# Altium project USB_2.0_HUB.PrjPcb
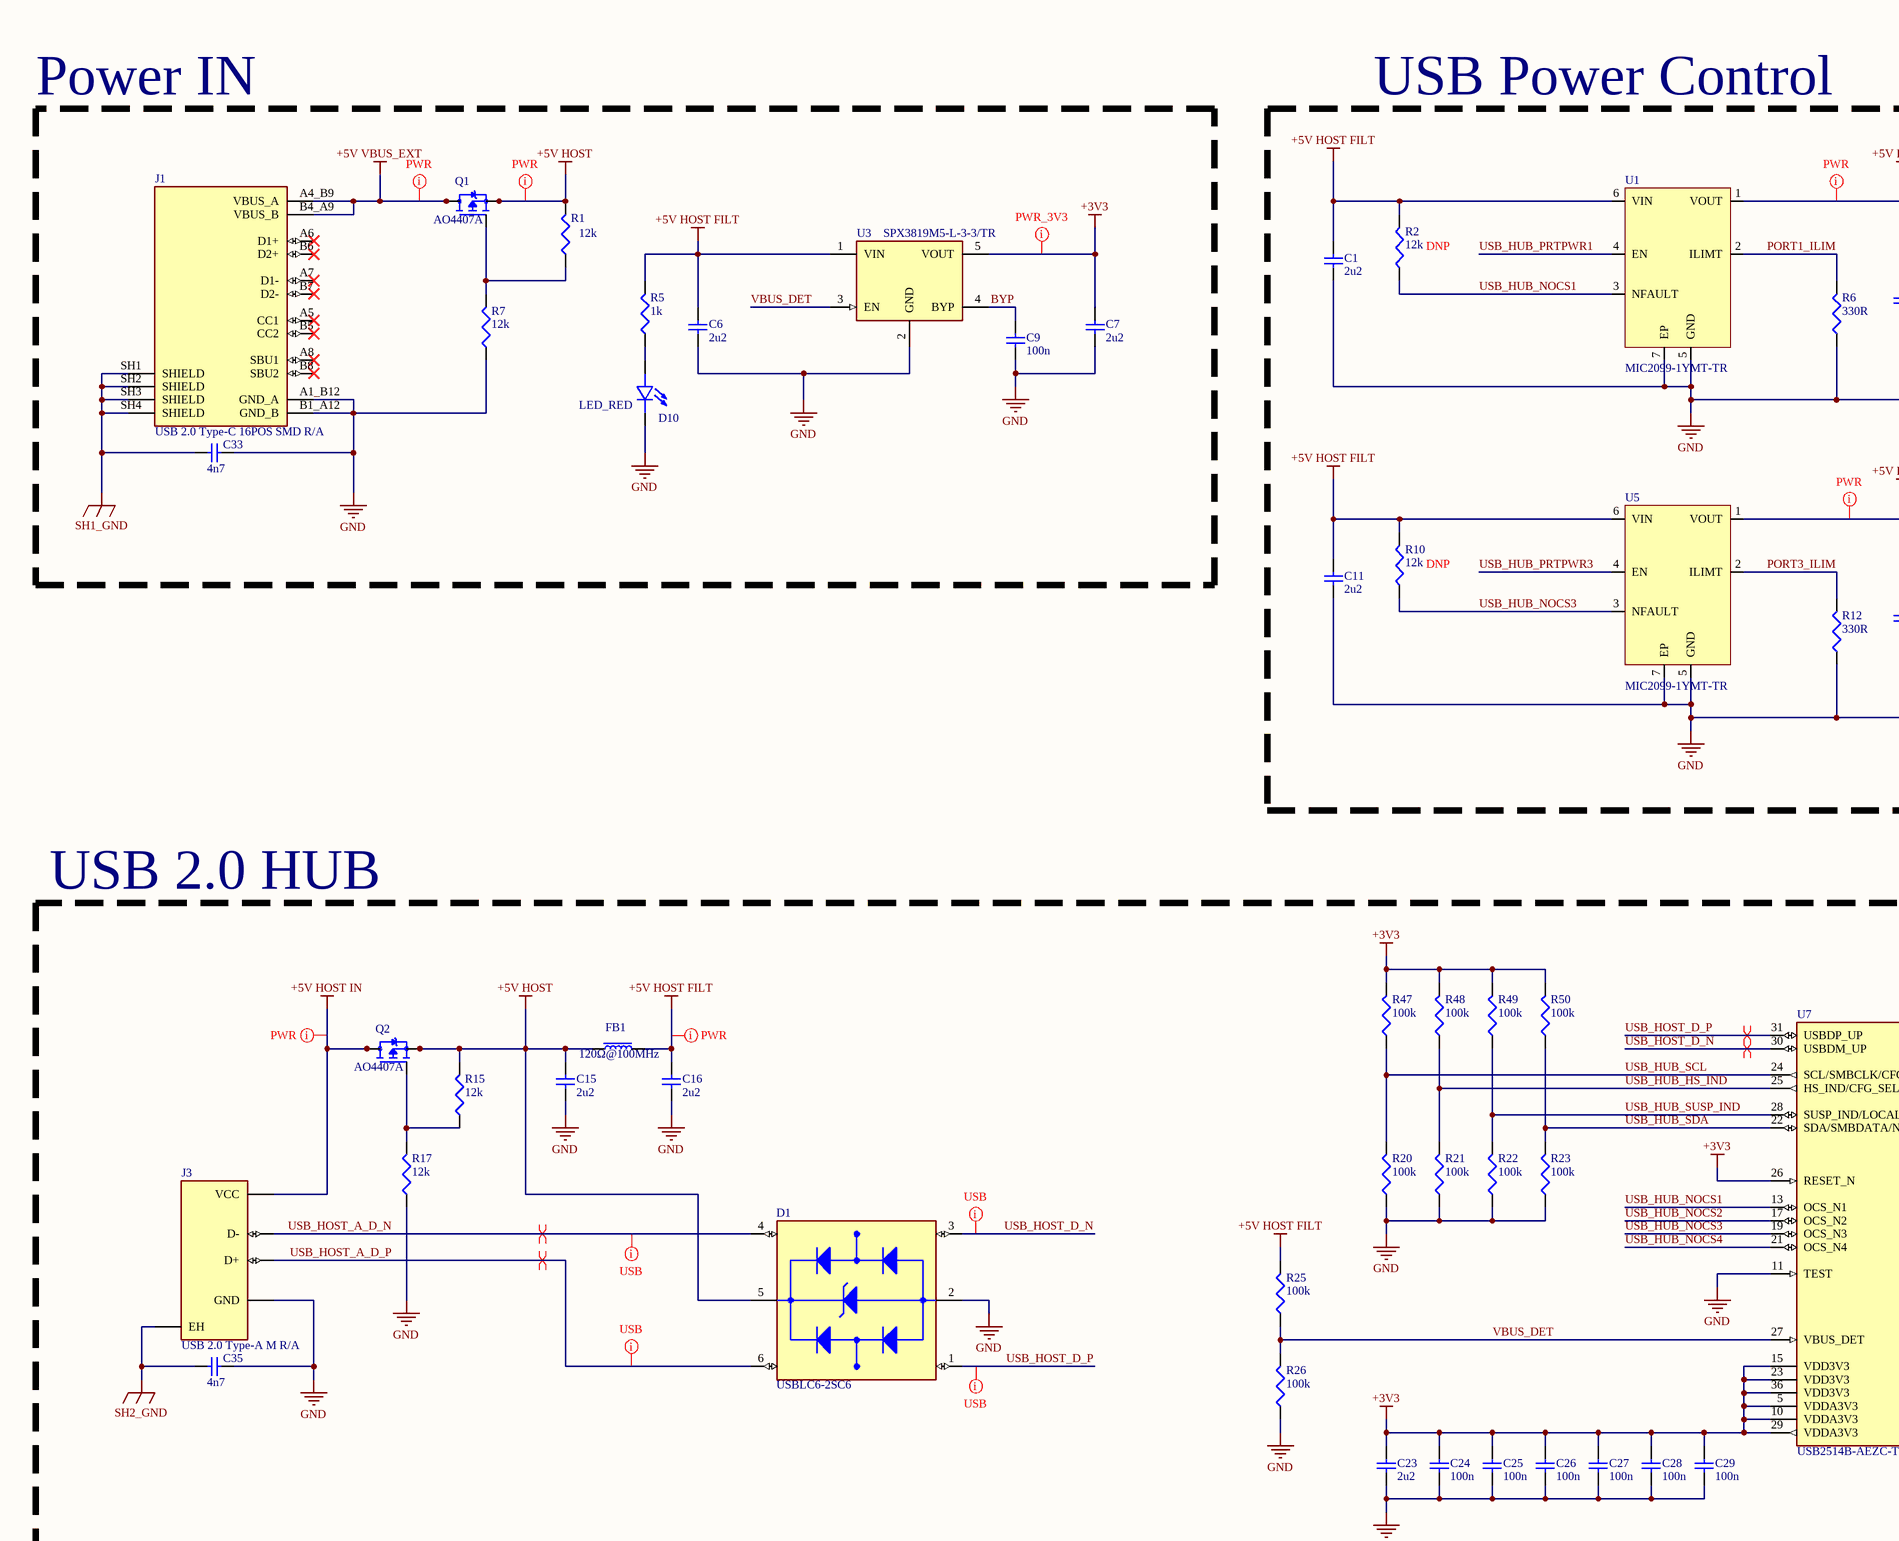
[diagram p0: USB_HUB_IC.SchDoc, top left]
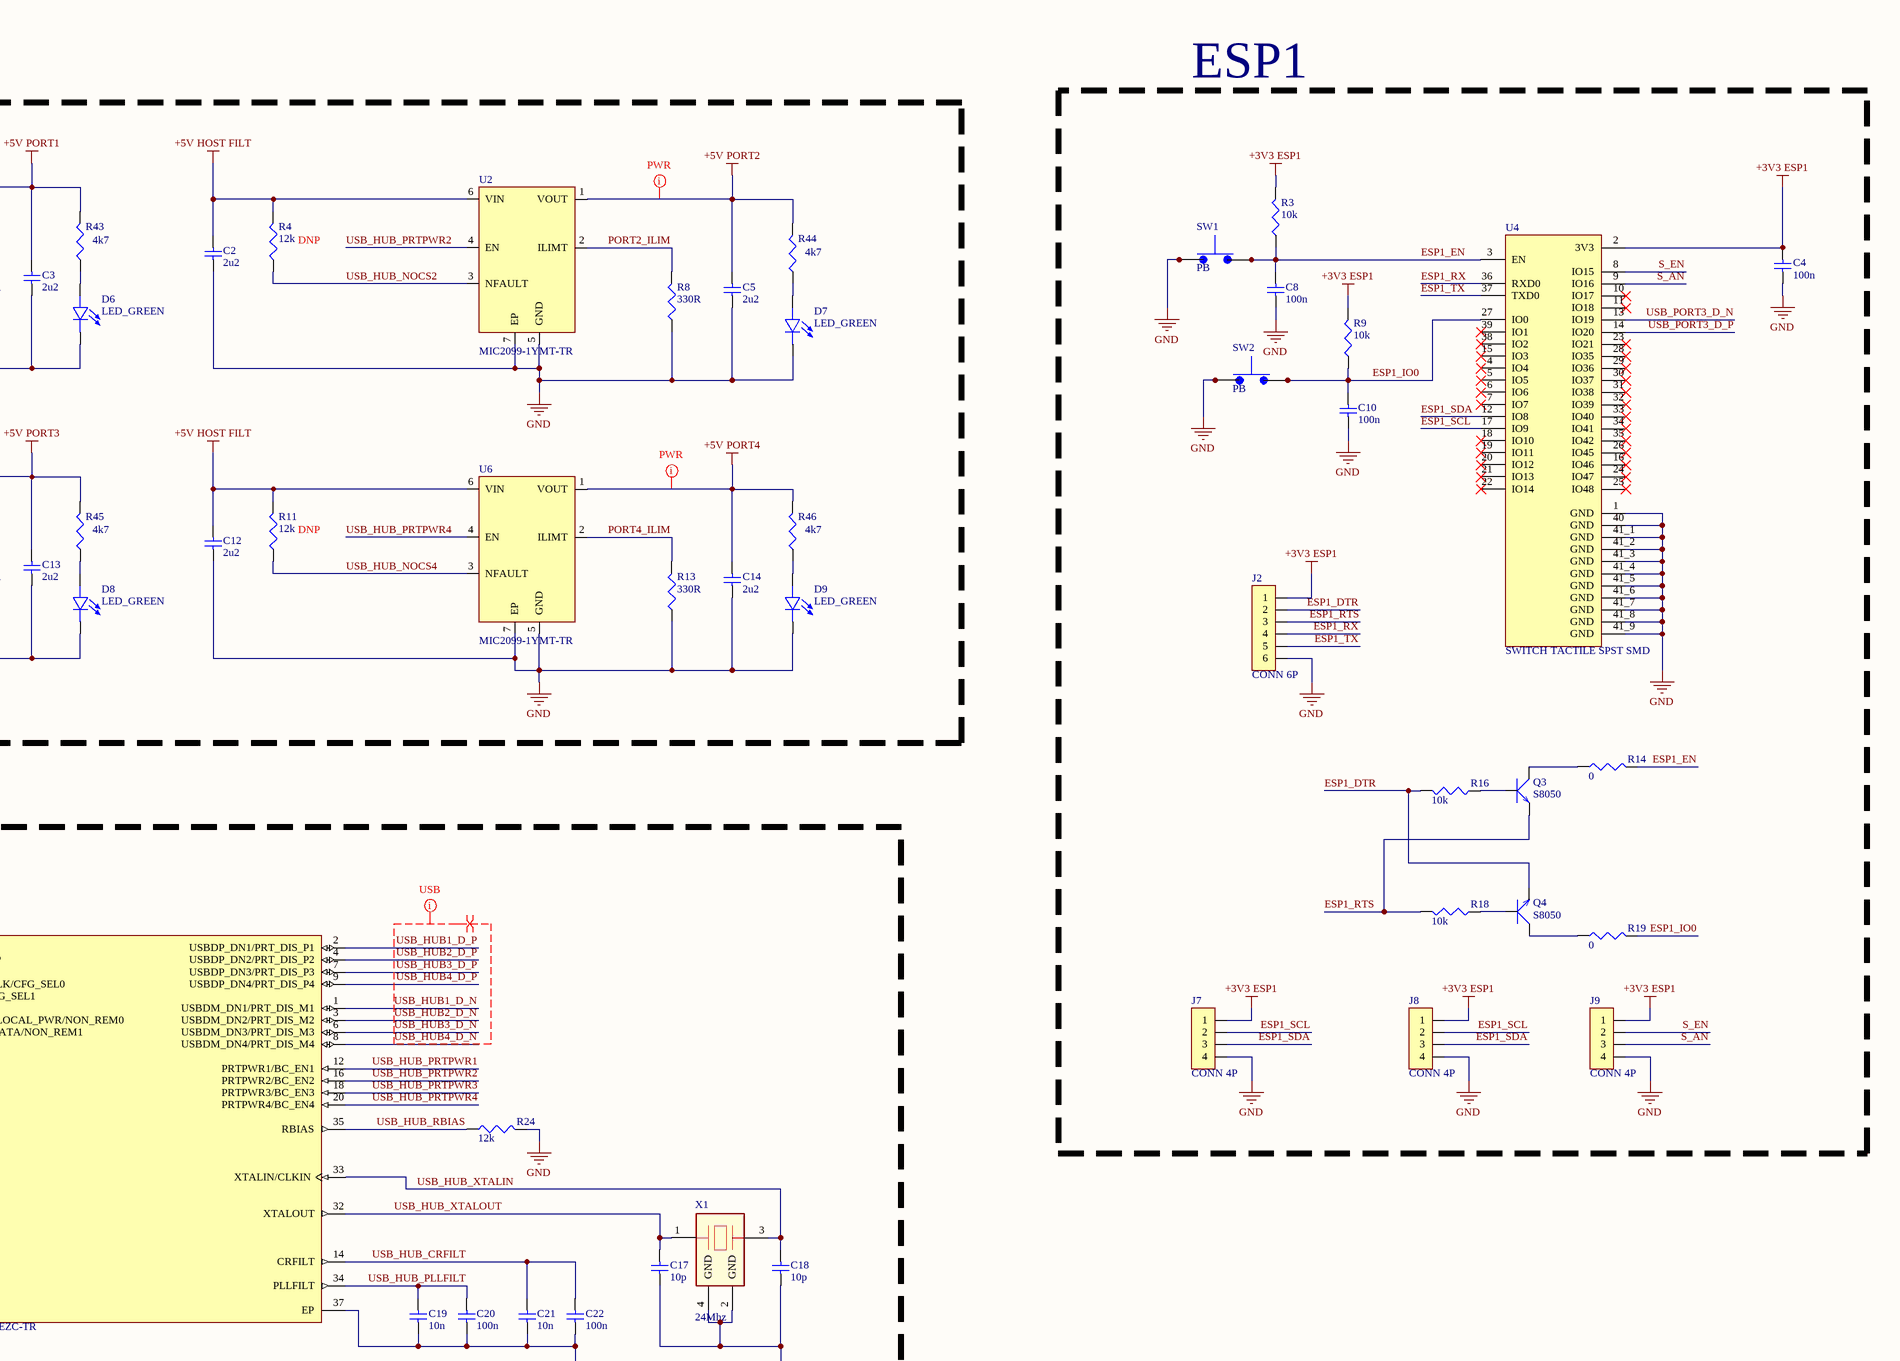
[diagram p1: USB_HUB_IC.SchDoc, top right]
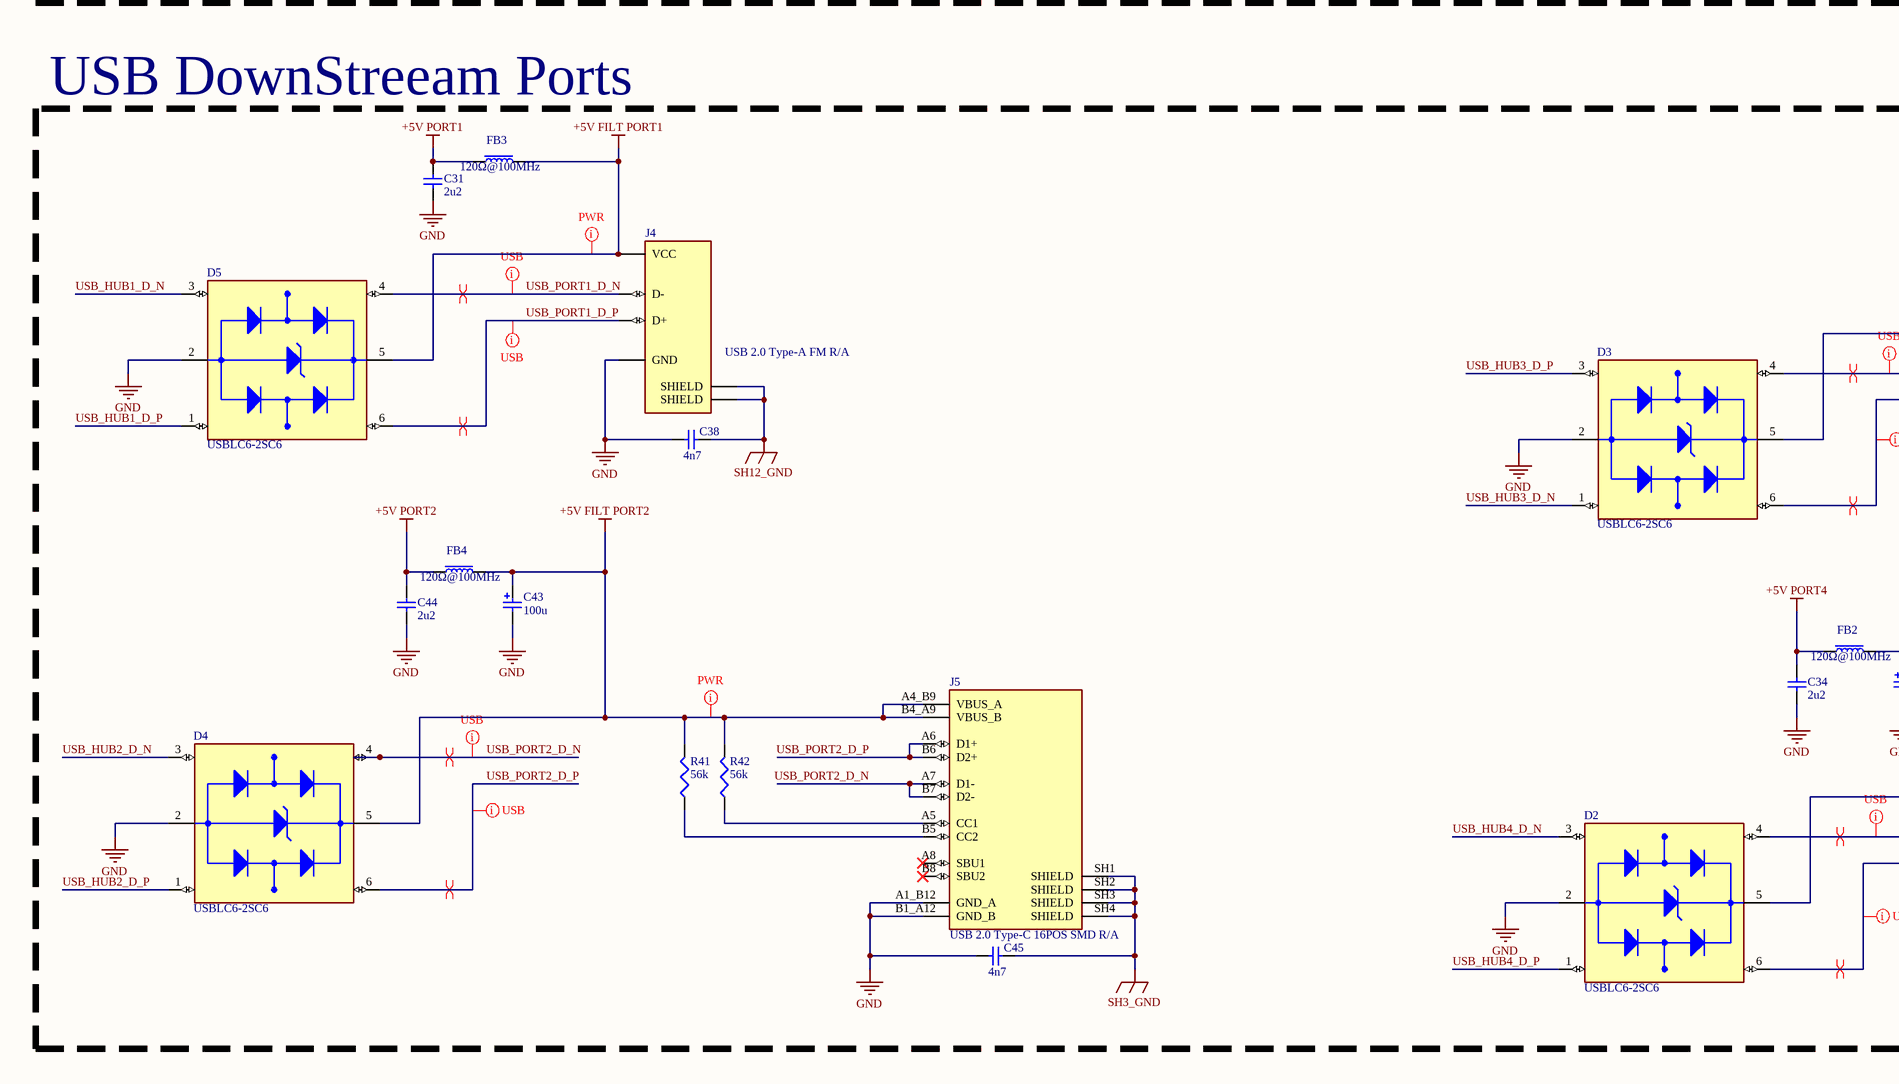
[diagram p2: USB_HUB_IC.SchDoc, bottom left]
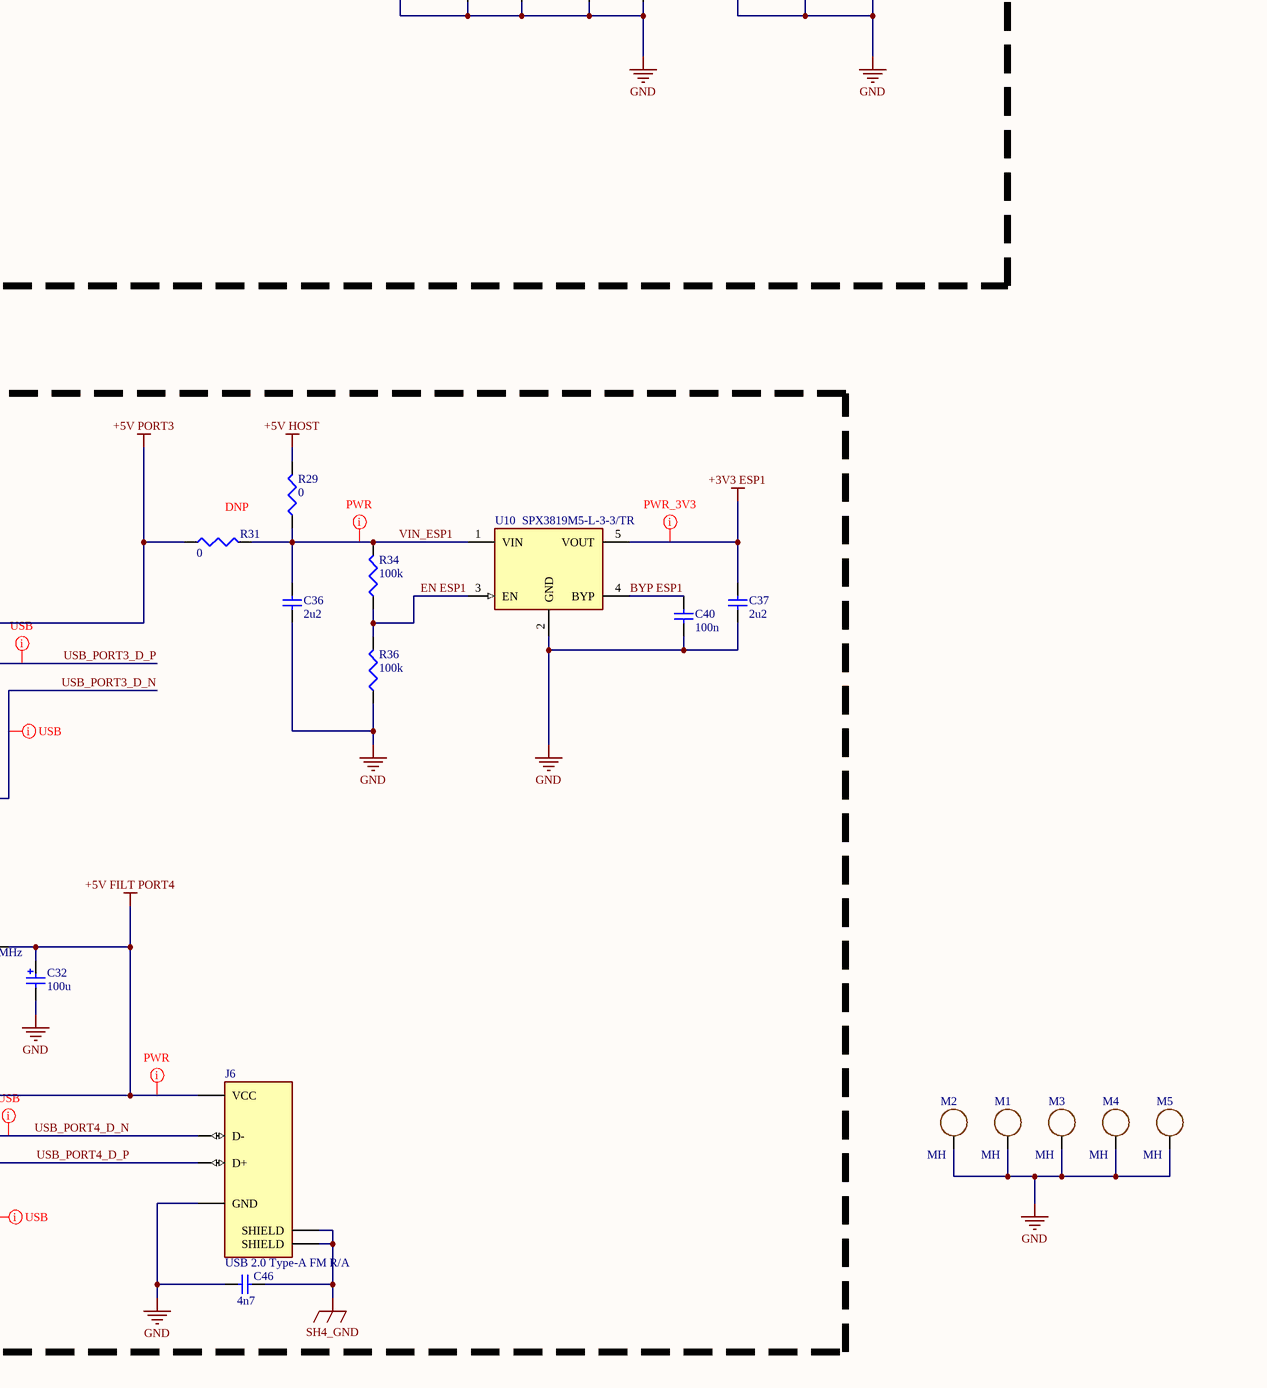
[diagram p3: USB_HUB_IC.SchDoc, bottom right]
1 sheet, 125 parts. Net scope: global (net labels, ports and power ports of the same name join across sheets).
Board file: USB2.0_HUB.PcbDoc

## Sheet USB_HUB_IC.SchDoc
size A1; SheetNumber: 1; SheetTotal: 1

### Parts
C1  2u2  [CAP_0603]
C2  2u2  [CAP_0603]
C3  2u2  [CAP_0603]
C4  100n  [CAP_0603]
C5  2u2  [CAP_0603]
C6  2u2  [CAP_0603]
C7  2u2  [CAP_0603]
C8  100n  [CAP_0603]
C9  100n  [CAP_0603]
C10  100n  [CAP_0603]
C11  2u2  [CAP_0603]
C12  2u2  [CAP_0603]
C13  2u2  [CAP_0603]
C14  2u2  [CAP_0603]
C15  2u2  [CAP_0603]
C16  2u2  [CAP_0603]
C17  10p  [CAP_0603]
C18  10p  [CAP_0603]
C19  10n  [CAP_0603]
C20  100n  [CAP_0603]
C21  10n  [CAP_0603]
C22  100n  [CAP_0603]
C23  2u2  [CAP_0603]
C24  100n  [CAP_0603]
C25  100n  [CAP_0603]
C26  100n  [CAP_0603]
C27  100n  [CAP_0603]
C28  100n  [CAP_0603]
C29  100n  [CAP_0603]
C31  2u2  [CAP_0603]
C32  100u  [CAP_SMD]
C33  4n7  [CAP_0603]
C34  2u2  [CAP_0603]
C35  4n7  [CAP_0603]
C36  2u2  [CAP_0603]
C37  2u2  [CAP_0603]
C38  4n7  [CAP_0603]
C40  100n  [CAP_0603]
C43  100u  [CAP_SMD]
C44  2u2  [CAP_0603]
C45  4n7  [CAP_0603]
C46  4n7  [CAP_0603]
D1  USBLC6-2SC6  [USBLC6-2SC6_SOT-23-6L]
D2  USBLC6-2SC6  [USBLC6-2SC6_SOT-23-6L]
D3  USBLC6-2SC6  [USBLC6-2SC6_SOT-23-6L]
D4  USBLC6-2SC6  [USBLC6-2SC6_SOT-23-6L]
D5  USBLC6-2SC6  [USBLC6-2SC6_SOT-23-6L]
D6  LED_GREEN  [LED_0805]
D7  LED_GREEN  [LED_0805]
D8  LED_GREEN  [LED_0805]
D9  LED_GREEN  [LED_0805]
D10  LED_RED  [LED_0805]
FB1  120Ω@100MHz  [FB_0805]
FB2  120Ω@100MHz  [FB_0805]
FB3  120Ω@100MHz  [FB_0805]
FB4  120Ω@100MHz  [FB_0805]
J1  USB 2.0 Type-C 16POS SMD R/A  [GT-USB-7010B]
J2  CONN 6P  [JST_6P_GH_W/A]
J3  USB 2.0 Type-A M R/A  [Male USB 2.0 Type-A 4POS SMD R/A]
J4  USB 2.0 Type-A FM R/A  [Femalem USB 2.0 Type-A 4POS SMD R/A]
J5  USB 2.0 Type-C 16POS SMD R/A  [GT-USB-7010B]
J6  USB 2.0 Type-A FM R/A  [Femalem USB 2.0 Type-A 4POS SMD R/A]
J7  CONN 4P  [JST_4P_GH_R/A]
J8  CONN 4P  [JST_4P_GH_R/A]
J9  CONN 4P  [JST_4P_GH_R/A]
M1  MH  [M2_Mounting_Hole]
M2  MH  [M2_Mounting_Hole]
M3  MH  [M2_Mounting_Hole]
M4  MH  [M2_Mounting_Hole]
M5  MH  [M2_Mounting_Hole]
Q1  AO4407A  [AO4407A_SOIC-8]
Q2  AO4407A  [AO4407A_SOIC-8]
Q3  S8050  [S8050_SOT-23]
Q4  S8050  [S8050_SOT-23]
R1  12k  [RES_0603]
R2  12k  [RES_0603]
R3  10k  [RES_0603]
R4  12k  [RES_0603]
R5  1k  [RES_0603]
R6  330R  [RES_0603]
R7  12k  [RES_0603]
R8  330R  [RES_0603]
R9  10k  [RES_0603]
R10  12k  [RES_0603]
R11  12k  [RES_0603]
R12  330R  [RES_0603]
R13  330R  [RES_0603]
R14  0  [RES_0603]
R15  12k  [RES_0603]
R16  10k  [RES_0603]
R17  12k  [RES_0603]
R18  10k  [RES_0603]
R19  0  [RES_0603]
R20  100k  [RES_0603]
R21  100k  [RES_0603]
R22  100k  [RES_0603]
R23  100k  [RES_0603]
R24  12k  [RES_0603]
R25  100k  [RES_0603]
R26  100k  [RES_0603]
R29  0  [RES_0603]
R31  0  [RES_0603]
R34  100k  [RES_0603]
R36  100k  [RES_0603]
R41  56k  [RES_0603]
R42  56k  [RES_0603]
R43  4k7  [RES_0603]
R44  4k7  [RES_0603]
R45  4k7  [RES_0603]
R46  4k7  [RES_0603]
R47  100k  [RES_0603]
R48  100k  [RES_0603]
R49  100k  [RES_0603]
R50  100k  [RES_0603]
SW1  PB  [ALPSALPINE SKRPABE010]
SW2  PB  [ALPSALPINE SKRPABE010]
U1  MIC2099-1YMT-TR  [MIC2099_UDFN-6]
U2  MIC2099-1YMT-TR  [MIC2099_UDFN-6]
U3  SPX3819M5-L-3-3/TR  [SPX3819M5-L-3-3/TR_SOT-23-5]
U4  SWITCH TACTILE SPST SMD  [XCVR_ESP32-S3-WROOM-1U]
U5  MIC2099-1YMT-TR  [MIC2099_UDFN-6]
U6  MIC2099-1YMT-TR  [MIC2099_UDFN-6]
U7  USB2514B-AEZC-TR  [USB2514B_VQFN-36-EP(6x6)]
U10  SPX3819M5-L-3-3/TR  [SPX3819M5-L-3-3/TR_SOT-23-5]
X1  24Mhz  [SMD3225-4P]

### Blocks framed on the sheet
Power IN: C6 C7 C9 C33 D10 J1 Q1 R1 R5 R7 U3
USB Power Control: C1-C3 C5 C11-C14 D6-D9 R2 R4 R6 R8 R10-R13 R43-R46 U1 U2 U5 U6
ESP1: C4 C8 C10 J2 J7-J9 Q3 Q4 R3 R9 R14 R16 R18 R19 SW1 SW2 U4
USB 2.0 HUB: C15-C29 C35 D1 FB1 J3 Q2 R15 R17 R20-R26 R47-R50 U7 X1
USB DownStreeam Ports: C31 C32 C34 C36-C38 C40 C43-C46 D2-D5 FB2-FB4 J4-J6 R29 R31 R34 R36 R41 R42 U10

### Nets
+3V3: C7.2 C23.2 C24.2 C25.2 C26.2 C27.2 C28.2 C29.2 R47.2 R48.2 R49.2 R50.2 U3.5(VOUT) U7.5(VDDA3V3) U7.10(VDDA3V3) U7.15(VDD3V3) U7.23(VDD3V3) U7.26(RESET_N) U7.29(VDDA3V3) U7.36(VDD3V3)
+3V3 ESP1: C4.2 C37.2 J2.1 J7.1 J8.1 J9.1 R3.2 R9.2 U4.2(3V3) U10.5(VOUT)
+5V FILT PORT1: D5.5(VBUS) FB3.2 J4.1(VCC)
+5V FILT PORT2: C43.1 D4.5(VBUS) FB4.2 J5.A4_B9(VBUS_A) J5.B4_A9(VBUS_B) R41.2 R42.2
+5V FILT PORT4: C32.1 D2.5(VBUS) FB2.2 J6.1(VCC)
+5V HOST: C15.2 D1.5(VBUS) FB1.1 Q1.1(S) Q1.2(S) Q1.3(S) Q2.1(S) Q2.2(S) Q2.3(S) R1.2 R15.2 R29.2
+5V HOST FILT: C1.2 C2.2 C6.2 C11.2 C12.2 C16.2 FB1.2 R2.2 R4.2 R5.2 R10.2 R11.2 R25.2 U1.6(VIN) U2.6(VIN) U3.1(VIN) U5.6(VIN) U6.6(VIN)
+5V HOST IN: J3.1(VCC) Q2.5(D) Q2.6(D) Q2.7(D) Q2.8(D)
+5V PORT1: C3.2 C31.2 FB3.1 R43.2 U1.1(VOUT)
+5V PORT2: C5.2 C44.2 FB4.1 R44.2 U2.1(VOUT)
+5V PORT3: C13.2 D3.5(VBUS) R31.1 R45.2 U5.1(VOUT)
+5V PORT4: C14.2 C34.2 FB2.1 R46.2 U6.1(VOUT)
+5V VBUS_EXT: J1.A4_B9(VBUS_A) J1.B4_A9(VBUS_B) Q1.5(D) Q1.6(D) Q1.7(D) Q1.8(D)
GND: C1.1 C2.1 C3.1 C4.1 C5.1 C6.1 C7.1 C8.1 C9.1 C10.1 C11.1 C12.1 C13.1 C14.1 C15.1 C16.1 C17.1 C18.1 C19.1 C20.1 C21.1 C22.1 C23.1 C24.1 C25.1 C26.1 C27.1 C28.1 C29.1 C31.1 C32.2 C33.2 C34.1 C35.2 C36.1 C37.1 C38.1 C40.1 C43.2 C44.1 C45.1 C46.1 D1.2(GND) D2.2(GND) D3.2(GND) D4.2(GND) D5.2(GND) D6.C D7.C D8.C D9.C D10.C J1.A1_B12(GND_A) J1.B1_A12(GND_B) J2.6 J3.4(GND) J4.4(GND) J5.A1_B12(GND_A) J5.B1_A12(GND_B) J6.4(GND) J7.4 J8.4 J9.4 M1.1(H) M2.1(H) M3.1(H) M4.1(H) M5.1(H) R6.1 R7.1 R8.1 R12.1 R13.1 R17.1 R20.1 R21.1 R22.1 R23.1 R24.2 R26.1 R36.1 SW1.1 SW1.2 SW2.1 SW2.2 U1.5(GND) U1.7(EP) U2.5(GND) U2.7(EP) U3.2(GND) U4.1(GND) U4.40(GND) U4.41_1(GND) U4.41_2(GND) U4.41_3(GND) U4.41_4(GND) U4.41_5(GND) U4.41_6(GND) U4.41_7(GND) U4.41_8(GND) U4.41_9(GND) U5.5(GND) U5.7(EP) U6.5(GND) U6.7(EP) U7.11(TEST) U7.37(EP) U10.2(GND) X1.2(GND) X1.4(GND)
SH1_GND: C33.1 J1.SH1(SHIELD) J1.SH2(SHIELD) J1.SH3(SHIELD) J1.SH4(SHIELD)
SH2_GND: C35.1 J3.5(EH)
SH3_GND: C45.2 J5.SH1(SHIELD) J5.SH2(SHIELD) J5.SH3(SHIELD) J5.SH4(SHIELD)
SH4_GND: C46.2 J6.5(SHIELD) J6.6(SHIELD)
SH12_GND: C38.2 J4.5(SHIELD) J4.6(SHIELD)
BYP: C9.2 U3.4(BYP)
BYP ESP1: C40.2 U10.4(BYP)
EN ESP1: R34.1 R36.2 U10.3(EN)
ESP1_DTR: J2.2 Q4.2(E) R16.2
ESP1_EN: C8.2 R3.1 R14.2 SW1.3 SW1.4 U4.3(EN)
ESP1_IO0: C10.2 R9.1 R19.2 SW2.3 SW2.4 U4.27(IO0)
ESP1_RTS: J2.3 Q3.2(E) R18.2
ESP1_RX: J2.4 U4.36(RXD0)
ESP1_SCL: J7.2 J8.2 U4.17(IO9)
ESP1_SDA: J7.3 J8.3 U4.12(IO8)
ESP1_TX: J2.5 U4.37(TXD0)
PORT1_ILIM: R6.2 U1.2(ILIMT)
PORT2_ILIM: R8.2 U2.2(ILIMT)
PORT3_ILIM: R12.2 U5.2(ILIMT)
PORT4_ILIM: R13.2 U6.2(ILIMT)
S_AN: J9.3 U4.9(IO16)
S_EN: J9.2 U4.8(IO15)
USB_HOST_A_D_N: D1.4(I/O2_OUT) J3.2(D-)
USB_HOST_A_D_P: D1.6(I/O1_OUT) J3.3(D+)
USB_HOST_D_N: D1.3(I/O2_IN) U7.30(USBDM_UP)
USB_HOST_D_P: D1.1(I/O1_IN) U7.31(USBDP_UP)
USB_HUB1_D_N: D5.3(I/O2_IN) U7.1(USBDM_DN1/PRT_DIS_M1)
USB_HUB1_D_P: D5.1(I/O1_IN) U7.2(USBDP_DN1/PRT_DIS_P1)
USB_HUB2_D_N: D4.3(I/O2_IN) U7.3(USBDM_DN2/PRT_DIS_M2)
USB_HUB2_D_P: D4.1(I/O1_IN) U7.4(USBDP_DN2/PRT_DIS_P2)
USB_HUB3_D_N: D3.1(I/O1_IN) U7.6(USBDM_DN3/PRT_DIS_M3)
USB_HUB3_D_P: D3.3(I/O2_IN) U7.7(USBDP_DN3/PRT_DIS_P3)
USB_HUB4_D_N: D2.3(I/O2_IN) U7.8(USBDM_DN4/PRT_DIS_M4)
USB_HUB4_D_P: D2.1(I/O1_IN) U7.9(USBDP_DN4/PRT_DIS_P4)
USB_HUB_CRFILT: C21.2 C22.2 U7.14(CRFILT)
USB_HUB_HS_IND: R21.2 R48.1 U7.25(HS_IND/CFG_SEL1)
USB_HUB_NOCS1: R2.1 U1.3(NFAULT) U7.13(OCS_N1)
USB_HUB_NOCS2: R4.1 U2.3(NFAULT) U7.17(OCS_N2)
USB_HUB_NOCS3: R10.1 U5.3(NFAULT) U7.19(OCS_N3)
USB_HUB_NOCS4: R11.1 U6.3(NFAULT) U7.21(OCS_N4)
USB_HUB_PLLFILT: C19.2 C20.2 U7.34(PLLFILT)
USB_HUB_PRTPWR1: U1.4(EN) U7.12(PRTPWR1/BC_EN1)
USB_HUB_PRTPWR2: U2.4(EN) U7.16(PRTPWR2/BC_EN2)
USB_HUB_PRTPWR3: U5.4(EN) U7.18(PRTPWR3/BC_EN3)
USB_HUB_PRTPWR4: U6.4(EN) U7.20(PRTPWR4/BC_EN4)
USB_HUB_RBIAS: R24.1 U7.35(RBIAS)
USB_HUB_SCL: R20.2 R47.1 U7.24(SCL/SMBCLK/CFG_SEL0)
USB_HUB_SDA: R23.2 R50.1 U7.22(SDA/SMBDATA/NON_REM1)
USB_HUB_SUSP_IND: R22.2 R49.1 U7.28(SUSP_IND/LOCAL_PWR/NON_REM0)
USB_HUB_XTALIN: C18.2 U7.33(XTALIN/CLKIN) X1.3
USB_HUB_XTALOUT: C17.2 U7.32(XTALOUT) X1.1
USB_PORT1_D_N: D5.4(I/O2_OUT) J4.2(D-)
USB_PORT1_D_P: D5.6(I/O1_OUT) J4.3(D+)
USB_PORT2_D_N: D4.4(I/O2_OUT) J5.A7(D1-) J5.B7(D2-)
USB_PORT2_D_P: D4.6(I/O1_OUT) J5.A6(D1+) J5.B6(D2+)
USB_PORT3_D_N: D3.6(I/O1_OUT) U4.13(IO19)
USB_PORT3_D_P: D3.4(I/O2_OUT) U4.14(IO20)
USB_PORT4_D_N: D2.4(I/O2_OUT) J6.2(D-)
USB_PORT4_D_P: D2.6(I/O1_OUT) J6.3(D+)
VBUS_DET: R25.1 R26.2 U3.3(EN) U7.27(VBUS_DET)
VIN_ESP1: C36.2 R29.1 R31.2 R34.2 U10.1(VIN)
NetD6_A: D6.A R43.1
NetD7_A: D7.A R44.1
NetD8_A: D8.A R45.1
NetD9_A: D9.A R46.1
NetD10_A: D10.A R5.1
NetJ5_A5: J5.A5(CC1) R42.1
NetJ5_B5: J5.B5(CC2) R41.1
NetQ1_4: Q1.4(G) R1.1 R7.2
NetQ2_4: Q2.4(G) R15.1 R17.2
NetQ3_1: Q3.1(B) R16.1
NetQ3_3: Q3.3(C) R14.1
NetQ4_1: Q4.1(B) R18.1
NetQ4_3: Q4.3(C) R19.1

Not connected (* = marked no-connect by the designer): J1 A5(CC1)* A6(D1+)* A7(D1-)* A8(SBU1)* B5(CC2)* B6(D2+)* B7(D2-)* B8(SBU2)*; J5 A8(SBU1)* B8(SBU2)*; U4 4(IO4)* 5(IO5)* 6(IO6)* 7(IO7)* 10(IO17)* 11(IO18)* 15(IO3)* 16(IO46)* 18(IO10)* 19(IO11)* 20(IO12)* 21(IO13)* 22(IO14)* 23(IO21)* 24(IO47)* 25(IO48)* 26(IO45)* 28(IO35)* 29(IO36)* 30(IO37)* 31(IO38)* 32(IO39)* 33(IO40)* 34(IO41)* 35(IO42)* 38(IO2)* 39(IO1)*

### Layout directives
differential pair: USB_HOST_A_D_N, USB_HOST_A_D_P, USB_HOST_D_N, USB_HOST_D_P, USB_HUB1_D_N, USB_HUB1_D_P, USB_HUB2_D_N, USB_HUB2_D_P, USB_HUB3_D_N, USB_HUB3_D_P, USB_HUB4_D_N, USB_HUB4_D_P, USB_PORT1_D_N, USB_PORT1_D_P, USB_PORT2_D_N, USB_PORT2_D_P, USB_PORT3_D_N, USB_PORT3_D_P, USB_PORT4_D_N, USB_PORT4_D_P
net class USB: USB_HOST_A_D_N, USB_HOST_A_D_P, USB_HOST_D_N, USB_HOST_D_P, USB_HUB1_D_N, USB_HUB1_D_P, USB_HUB2_D_N, USB_HUB2_D_P, USB_HUB3_D_N, USB_HUB3_D_P, USB_HUB4_D_N, USB_HUB4_D_P, USB_PORT1_D_N, USB_PORT1_D_P, USB_PORT2_D_N, USB_PORT2_D_P, USB_PORT3_D_N, USB_PORT3_D_P, USB_PORT4_D_N, USB_PORT4_D_P
net class PWR: +5V FILT PORT1, +5V FILT PORT2, +5V FILT PORT4, +5V HOST, +5V HOST FILT, +5V HOST IN, +5V PORT1, +5V PORT2, +5V PORT3, +5V PORT4, +5V VBUS_EXT, VIN_ESP1
net class PWR_3V3: +3V3, +3V3 ESP1

### Notes on the sheet
- (near R2) DNP
- (near R4) DNP
- (near R10) DNP
- (near R11) DNP
- (near R31) DNP

### Library data of the parts
C1-C3 C5 C11-C16 C23 C31 C34 C44 = YAGEO CC0603KRX7R9BB104_1: CAP CER 2.2uF 16V X7R 0603; Manufacturer: YAGEO; Manufacturer Part Number: CC0603KRX7R7BB225; LCSC Part Number: C914769; Package: 0603; Mounting Type: SMD; ComponentLink2Description: Digikey Link; ComponentLink3Description: LCSC Link; ComponentLink3URL: https://www.lcsc.com/product-detail/C914769.html?spm=wm.fly.bg.0.xh___wm.sxq.dhl.mly.12-0-4&lcsc_vid=QlAIX1RQQQJfX1VRTwcNAQJXTlRaUQBVEQBYAwJfFFcxVlNRQ1VcX1FSRFRbUDsOAxUeFF5JWBYZEEoKFBINSQcJGk4dAgUUFAk%3D
C4 C8-C10 C20 C22 C24-C29 C40 = YAGEO CC0603KRX7R9BB104: 100nF ±10% 50V Ceramic Capacitor X7R 0603; Manufacturer: YAGEO; Manufacturer Part Number: CC0603KRX7R9BB104; LCSC Part Number: C14663; Package: 0603; Mounting Type: SMD; ComponentLink2Description: Digikey Link; ComponentLink3Description: LCSC Link; ComponentLink3URL: https://www.lcsc.com/product-detail/C14663.html?spm=wm.fly.bg.0.xh___wm.sxq.dhl.mly.12-0-4&lcsc_vid=QlAIX1RQQQJfX1VRTwcNAQJXTlRaUQBVEQBYAwJfFFcxVlNRQ1VcX1FSRFRbUDsOAxUeFF5JWBYZEEoKFBINSQcJGk4dAgUUFAk%3D
C6 C7 C36 C37 = YAGEO CC0603KRX7R7BB225: 2.2uF ±10% 16V Ceramic Capacitor X7R 0603; Manufacturer: YAGEO; Manufacturer Part Number: CC0603KRX7R7BB225; LCSC Part Number: C914769; Package: 0603; Mounting Type: SMD; ComponentLink2Description: Digikey Link; ComponentLink3Description: LCSC Link; ComponentLink3URL: https://www.lcsc.com/product-detail/C914769.html?spm=wm.fly.bg.0.xh___wm.sxq.dhl.mly.12-0-4&lcsc_vid=QlAIX1RQQQJfX1VRTwcNAQJXTlRaUQBVEQBYAwJfFFcxVlNRQ1VcX1FSRFRbUDsOAxUeFF5JWBYZEEoKFBINSQcJGk4dAgUUFAk%3D
C17 C18 = YAGEO CC0603FRNPO9BN100: 10pF ±1% 50V Ceramic Capacitor NP0 0603; Manufacturer: YAGEO; Manufacturer Part Number: CC0603FRNPO9BN100; LCSC Part Number: C309467; Package: 0603; Mounting Type: SMD; ComponentLink2Description: Digikey Link; ComponentLink3Description: LCSC Link; ComponentLink3URL: https://www.lcsc.com/product-detail/C309467.html?spm=wm.fly.bg.0.xh___wm.fly.dhl.mly.12-0-4&lcsc_vid=QlAIX1RQQQJfX1VRTwcNAQJXTlRaUQBVEQBYAwJfFFcxVlNRQ1ReUVNTQlhZUDtW
C19 C21 = YAGEO CC0603KRX7R9BB103: 10nF ±10% 50V Ceramic Capacitor X7R 0603; Manufacturer: YAGEO; Manufacturer Part Number: CC0603KRX7R9BB103; LCSC Part Number: C100042; Package: 0603; Mounting Type: SMD; ComponentLink2Description: Digikey Link; ComponentLink3Description: LCSC Link; ComponentLink3URL: https://www.lcsc.com/product-detail/C100042.html?spm=wm.fly.bg.0.xh___wm.sxq.dhl.mly.12-0-4&lcsc_vid=QlAIX1RQQQJfX1VRTwcNAQJXTlRaUQBVEQBYAwJfFFcxVlNRQ1ReUVNTQlhZUDtW
C32 C43 = CAP ALUM 100uF: 100uF ±20% 16V Aluminum Electrolytic Capacitors 2000hrs@105℃; Manufacturer: PANASONIC; Manufacturer Part Number: EEEFT1C101AR; LCSC Part Number: C336792; Package: SMD; Mounting Type: SMD; ComponentLink2Description: Digikey Link; ComponentLink3Description: LCSC Link; ComponentLink3URL: https://www.lcsc.com/product-detail/C336792.html
C33 C35 C38 C45 C46 = YAGEO CC0603JRX7R9BB472: 4.7nF ±5% 50V Ceramic Capacitor X7R 0603; Manufacturer: YAGEO; Manufacturer Part Number: CC0603JRX7R9BB472; LCSC Part Number: C115060; Package: 0603; Mounting Type: SMD; ComponentLink2Description: Digikey Link; ComponentLink3Description: LCSC Link
D1-D5 = ST USBLC6-2SC6: 17VC Clamp 5A Ipp ESD DIODE SOT-23-6L; Manufacturer: ST; Manufacturer Part Number: USBLC6-2SC6; LCSC Part Number: C7519; Package: SOT-23-6L; ComponentLink1Description: Digikey Link; ComponentLink2Description: LCSC Link; ComponentLink2URL: https://www.lcsc.com/product-detail/C7519.html?s_z=n_usblc6-2sc6&spm=wm.ssy.bg.0.xh&lcsc_vid=QlAIX1RQQQJfX1VRTwcNAQJXTlRaUQBVEQBYAwJfFFcxVlNRQ1VbUVRUTldbUTsOAxUeFF5JWBYZEEoKFBINSQcJGk4%3D; Mounting Type: SMD
D6-D9 = LED_GREEN: Green 535nm LED Indication - Discrete 2.6V~3.2V 0805; Manufacturer: TONYU; Manufacturer Part Number: DY-S2012508UGC-T5-3T-03; LCSC Part Number: C7280944; Package: 0805; ComponentLink1Description: Digikey Link; ComponentLink2Description: LCSC Link; ComponentLink2URL: https://www.lcsc.com/product-detail/C7280944.html?spm=wm.fly.bg.2.xh&lcsc_vid=ElNWVwADR1BcUgADEwJfBlBQQ1hZBQcDEVVXV1VQE1kxVlNRQlFYU1JXRlJZVTsOAxUeFF5JWBYZEEoKFBINSQcJGk4%3D; Mounting Type: SMD
D10 = LED_RED: LED RED WATER CLEAR 0805 SMD; Manufacturer: Guiguang light; Manufacturer Part Number: GL0805UR01; LCSC Part Number: C51933307; Package: 0805; ComponentLink1Description: Digikey Link; ComponentLink2Description: LCSC Link; ComponentLink2URL: https://www.lcsc.com/product-detail/C51933307.html; Mounting Type: SMD
FB1-FB4 = muRata BLM21PG121SN1D: FERRITE BEAD 120Ω 0805 1LN; Manufacturer: muRata; Manufacturer Part Number: BLM21PG121SN1D; LCSC Part Number: C79382; Package: 0805; Mounting Type: SMD; ComponentLink2Description: Digikey Link; ComponentLink3Description: LCSC Link; ComponentLink3URL: https://www.lcsc.com/product-detail/C79382.html
J1 J5 = GT-USB-7010B: USB-C (USB TYPE-C) Receptacle Connector 16 Position Surface Mount, Right Angle; Manufacturer: G-Switch; Manufacturer Part Number: GT-USB-7010ASV; DigiKey Part Number: *; LCSC Part Number: C2988369; Package: SMD; Mounting Type: SMD; ComponentLink1Description: Digikey Link; ComponentLink1URL: *; ComponentLink2Description: LCSC Link; ComponentLink2URL: https://www.lcsc.com/product-detail/C2988369.html?s_z=n_C2988369
J2 = JST_6P_GH_R/A: Connector Header 6 position 1.25mm Pitch 1A Surface Mount, Right Angle -25℃~+85℃; Manufacturer: SHOU HAN; Manufacturer Part Number: 1.25-6PWTDK; LCSC Part Number: C3008556; Package: SMD,P=1.25mm,Surface Mount,Right Angle; ComponentLink1Description: Digikey Link; Mounting Type: SMD; ComponentLink2Description: LCSC Link; ComponentLink2URL: https://www.lcsc.com/product-detail/C3008556.html?spm=wm.fly.bg.0.xh&lcsc_vid=QlAIX1RQQQJfX1VRTwcNAQJXTlRaUQBVEQBYAwJfFFcxVlNRQ1deVldfQ1JYVTtW
J3 = USB 2.0 Type-A M R/A: USB-A (USB TYPE-A) Receptacle Connector 4 Position Surface Mount, Right Angle; Manufacturer: XUNPU; Manufacturer Part Number: USB-212-BCW; LCSC Part Number: C720521; Package: SMD; ComponentLink1Description: Digikey Link; ComponentLink2Description: LCSC Link; ComponentLink2URL: https://www.lcsc.com/product-detail/C720521.html?spm=wm.fly.bg.0.xh&lcsc_vid=QlAIX1RQQQJfX1VRTwcNAQJXTlRaUQBVEQBYAwJfFFcxVlNRQ1hdVF1eQ1lbUztW; Mounting Type: SMD
J4 J6 = USB 2.0 Type-A FM R/A: USB-A (USB TYPE-A) Receptacle Connector 4 Position Surface Mount, Right Angle; Manufacturer: SHOU HAN; Manufacturer Part Number: 10.0 QHHTZB6.3; LCSC Part Number: C668591; Package: SMD; ComponentLink1Description: Digikey Link; ComponentLink2Description: LCSC Link; ComponentLink2URL: https://www.lcsc.com/product-detail/C668591.html; Mounting Type: SMD
J7-J9 = JST_4P_GH_R/A: Connector Header 4 position 1.25mm Pitch 1A Surface Mount, Right Angle -25℃~+85℃; Manufacturer: XUNPU; Manufacturer Part Number: WAFER-GH1.25-4PWB; LCSC Part Number: C3029379; Package: SMD,P=1.25mm,Surface Mount,Right Angle; ComponentLink1Description: Digikey Link; Mounting Type: SMD; ComponentLink2Description: LCSC Link; ComponentLink2URL: https://www.lcsc.com/product-detail/C3029379.html?spm=wm.fly.bg.0.xh&lcsc_vid=QlAIX1RQQQJfX1VRTwcNAQJXTlRaUQBVEQBYAwJfFFcxVlNRQ1deVldfQ1JYVTtW
M1-M5 = M2_Mounting_hole
Q1 Q2 = AOS AO4407A: P-Channel 30V 12A 3.1W Surface Mount SOIC-8; Manufacturer: AOS; Manufacturer Part Number: AO4407A; LCSC Part Number: C16072; Package: SOIC-8; ComponentLink1Description: Digikey Link; ComponentLink2Description: LCSC Link; ComponentLink2URL: https://www.lcsc.com/product-detail/C16072.html?s_z=n_AO4407A; Mounting Type: SMD
Q3 Q4 = JSMSEMI S8050: Bipolar (BJT) Transistor 25V 500mA 150MHz 300mW Surface Mount SOT-23; Manufacturer: JSMSEMI; Manufacturer Part Number: S8050; LCSC Part Number: C916390; Package: SOT-23; ComponentLink1Description: Digikey Link; ComponentLink2Description: LCSC Link; ComponentLink2URL: https://www.lcsc.com/product-detail/C916390.html?s_z=n_S8050&spm=wm.ssy.bg.1.xh&lcsc_vid=QlAIX1RQQQJfX1VRTwcNAQJXTlRaUQBVEQBYAwJfFFcxVlNRQ1RXUVNXR1NXVTsOAxUeFF5JWBYZEEoKFBINSQcJGk4dAgUUFAk%3D; Mounting Type: SMD
R1 R2 R4 R7 R10 R11 R15 R17 R24 = YAGEO RC0603FR-0712KL: RES 12kΩ ±1% 100mW 0603; Manufacturer: YAGEO; Manufacturer Part Number: RC0603FR-0712KL; LCSC Part Number: C114659; Package: 0603; ComponentLink1Description: Digikey Link; Mounting Type: SMD; ComponentLink2Description: LCSC Link
R3 R9 R16 R18 = YAGEO RC0603FR-0710KL: 100mW 10kΩ 75V Thick Film Resistor ±100ppm/℃ ±1% 0603 Chip Resistor - Surface Mount RoHS; Manufacturer: YAGEO; Manufacturer Part Number: RC0603FR-0710KL; LCSC Part Number: C98220; Package: 0603; ComponentLink1Description: Digikey Link; Mounting Type: SMD; ComponentLink2Description: LCSC Link; ComponentLink2URL: https://www.lcsc.com/product-detail/C98220.html?spm=wm.fly.bg.0.xh___wm.ssy.dhl.mly.12-6-1&lcsc_vid=QlAIX1RQQQJfX1VRTwcNAQJXTlRaUQBVEQBYAwJfFFcxVlNRQ1RXVV1VT1FcVTsOAxUeFF5JWBYZEEoKFBINSQcJGk4%3D
R5 = YAGEO RC0603JR-071KL: 100mW 1kΩ 75V Thick Film Resistor ±100ppm/℃ ±5% 0603 Chip Resistor - Surface Mount RoHS; Manufacturer: YAGEO; Manufacturer Part Number: RC0603JR-071KL; LCSC Part Number: C14676; Package: 0603; ComponentLink1Description: Digikey Link; Mounting Type: SMD; ComponentLink2Description: LCSC Link; ComponentLink2URL: https://www.lcsc.com/product-detail/C14676.html
R6 R8 R12 R13 = YAGEO RC0603JR-07330RL: RES 330Ω ±5% 100mW 0603; Manufacturer: YAGEO; Manufacturer Part Number: RC0603JR-07330RL; LCSC Part Number: C105879; Package: 0603; ComponentLink1Description: Digikey Link; Mounting Type: SMD; ComponentLink2Description: LCSC Link; ComponentLink2URL: https://www.lcsc.com/product-detail/C105879.html?spm=wm.fly.bg.0.xh___wm.ssy.dhl.mly.12-6-1&lcsc_vid=QlAIX1RQQQJfX1VRTwcNAQJXTlRaUQBVEQBYAwJfFFcxVlNRQ1VWVFNXTlZeXzsOAxUeFF5JWBYZEEoKFBINSQcJGk4dAgUUFAk%3D
R14 R19 R29 R31 = YAGEO RC0603JR-070RL: 100mW 0Ω 75V Thick Film Resistor ±5% 0603 Chip Resistor - Surface Mount RoHS; Manufacturer: YAGEO; Manufacturer Part Number: RC0603JR-070RL; LCSC Part Number: C95177; Package: 0603; ComponentLink1Description: Digikey Link; Mounting Type: SMD; ComponentLink2Description: LCSC Link
  R14 R19: ComponentLink2URL: https://www.lcsc.com/product-detail/C98220.html?spm=wm.fly.bg.0.xh___wm.ssy.dhl.mly.12-6-1&lcsc_vid=QlAIX1RQQQJfX1VRTwcNAQJXTlRaUQBVEQBYAwJfFFcxVlNRQ1RXVV1VT1FcVTsOAxUeFF5JWBYZEEoKFBINSQcJGk4%3D
  R29 R31: ComponentLink2URL: https://www.lcsc.com/product-detail/C95177.html?spm=wm.fly.bg.0.xh___wm.ssy.dhl.mly.12-6-1&lcsc_vid=QlAIX1RQQQJfX1VRTwcNAQJXTlRaUQBVEQBYAwJfFFcxVlNRQ1RXVV1VT1FcVTsOAxUeFF5JWBYZEEoKFBINSQcJGk4%3D
R20-R23 R25 R26 R34 R36 R47-R50 = YAGEO RC0603JR-07100KL: RES 100kΩ ±5% 100mW 0603; Manufacturer: YAGEO; Manufacturer Part Number: RC0603JR-07100KL; LCSC Part Number: C100048; Package: 0603; ComponentLink1Description: Digikey Link; Mounting Type: SMD; ComponentLink2Description: LCSC Link; ComponentLink2URL: https://www.lcsc.com/product-detail/C100048.html?spm=wm.fly.bg.1.xh___wm.ssy.dhl.mly.12-6-1&lcsc_vid=QlAIX1RQQQJfX1VRTwcNAQJXTlRaUQBVEQBYAwJfFFcxVlNRQ1VcX1FSRFRbUDsOAxUeFF5JWBYZEEoKFBINSQcJGk4dAgUUFAk%3D
R41 R42 = YAGEO RC0603FR-0756KL: 100mW 56kΩ 75V Thick Film Resistor ±100ppm/℃ ±1% 0603 Chip Resistor - Surface Mount RoHS; Manufacturer: YAGEO; Manufacturer Part Number: RC0603FR-0756KL; LCSC Part Number: C114630; Package: 0603; ComponentLink1Description: Digikey Link; Mounting Type: SMD; ComponentLink2Description: LCSC Link; ComponentLink2URL: https://www.lcsc.com/product-detail/C114630.html?spm=wm.fly.bg.0.xh___wm.sxq.dhl.mly.12-6-1&lcsc_vid=ElNWVwADR1BcUgADEwJfBlBQQ1hZBQcDEVVXV1VQE1kxVlNRQlFeU1BSRFhbUztW
R43-R46 = YAGEO RC0603JR-074K7L: 100mW 4.7kΩ 75V Thick Film Resistor ±100ppm/℃ ±5% 0603 Chip Resistor - Surface Mount RoHS; Manufacturer: YAGEO; Manufacturer Part Number: RC0603JR-074K7L; LCSC Part Number: C105428; Package: 0603; ComponentLink1Description: Digikey Link; Mounting Type: SMD; ComponentLink2Description: LCSC Link; ComponentLink2URL: https://www.lcsc.com/product-detail/C105428.html?spm=wm.fly.bg.0.xh___wm.sy.dhl.mly.12-6-1&lcsc_vid=ElNWVwADR1BcUgADEwJfBlBQQ1hZBQcDEVVXV1VQE1kxVlNRQlFYX1VWRVJfUztW
SW1 SW2 = ALPSALPINE SKRPABE010: Tactile Switch SPST 2.5mm 4.2mm x 3.2mm Surface Mount; Manufacturer: ALPSALPINE; Manufacturer Part Number: SKRPABE010; LCSC Part Number: C115360; Package: SMD-4P,4.2x3.2mm; ComponentLink1Description: Digikey Link; ComponentLink2Description: LCSC Link; ComponentLink2URL: https://www.lcsc.com/product-detail/C115360.html?s_z=n_C115360; Mounting Type: SMD
U1 U2 U5 U6 = MIC2099-1YMT-TR: UDFN-6 Power Distribution Switches, Load Drivers RoHS; Manufacturer: MICROCHIP; Manufacturer Part Number: MIC2099-1YMT-TR; LCSC Part Number: C621526; Package: UDFN-6; ComponentLink1Description: Digikey Link; ComponentLink2Description: LCSC Link; ComponentLink2URL: https://www.lcsc.com/product-detail/C621526.html?s_z=n_MIC2099&spm=wm.ssy.bg.0.xh&lcsc_vid=QlAIX1RQQQJfX1VRTwcNAQJXTlRaUQBVEQBYAwJfFFcxVlNRQ1RfU1ZVRFdWXzsOAxUeFF5JWBYZEEoKFBINSQcJGk4eFQsCAgIaSgADAwAHC0slRlVYUVdIHxUDCw%3D%3D; Mounting Type: SMD
U3 U10 = MaxLinear SPX3819M5-L-3-3/TR: 3.3V 16V Positive Fixed SOT-23-5 Voltage Regulators - Linear, Low Drop Out (LDO) Regulators RoHS; Manufacturer: MaxLinear; Manufacturer Part Number: SPX3819M5-L-3-3/TR; LCSC Part Number: C9055; Package: SOT-23-5; ComponentLink1Description: Digikey Link; ComponentLink2Description: LCSC Link; ComponentLink2URL: https://www.lcsc.com/product-detail/C9055.html?s_z=n_spx3819M5&spm=wm.ssy.bg.1.xh&lcsc_vid=QlAIX1RQQQJfX1VRTwcNAQJXTlRaUQBVEQBYAwJfFFcxVlNRQ1VWVl1VRFdYVDsOAxUeFF5JWBYZEEoKFBINSQcJGk4eFQsCAgIaSgADAwAHC0slQFNeUlZXWQkaCgg%3D; Mounting Type: SMD
U4 = ESP32-S3-WROOM-1U-N8: 2.4 GHz Wi-Fi (802.11 b/g/n) and Bluetooth 5 (LE) module; Manufacturer: ESPRESSIF; Manufacturer Part Number: ESP32-S3-WROOM-1U-N8; LCSC Part Number: C2980297; Package: SMD,19.2x18mm; Mounting Type: SMD; ComponentLink1Description: Digikey Link; ComponentLink1URL: *; ComponentLink2Description: LCSC Link; ComponentLink2URL: https://www.lcsc.com/product-detail/C2980297.html?s_z=n_esp32%2520s3%2520wroom1u
U7 = MICROCHIP USB2514B-AEZC-TR: 4 480Mbps Hub USB 2.0 VQFN-36-EP(6x6) Interface Controllers RoHS; Manufacturer: MICROCHIP; Manufacturer Part Number: USB2514B-AEZC-TR; LCSC Part Number: C16251; Package: VQFN-36-EP(6x6); ComponentLink1Description: Digikey Link; ComponentLink2Description: LCSC Link; ComponentLink2URL: https://www.lcsc.com/product-detail/C16251.html?s_z=n_usb2514B; Mounting Type: SMD
X1 = 24MHz 4P: Crystal 24MHz ±10ppm 9pF 30Ω SMD3225-4P; Manufacturer: TOGNJING; Manufacturer Part Number: XTM32024000FT00351001; LCSC Part Number: C41383244; Package: SMD3225-4P; ComponentLink1Description: Digikey Link; ComponentLink2Description: LCSC Link; ComponentLink2URL: https://www.lcsc.com/product-detail/C41383244.html?spm=wm.fly.bg.0.xh&lcsc_vid=QFAPUwAAQANZBgdRRwJcBAYDQlgNA1FUQgJZBgIFQAUxVlNRQ1ReXlRVR1dcVjsOAxUeFF5JWBYZEEoBGA4JCwFIFA4DSA%3D%3D; Mounting Type: SMD